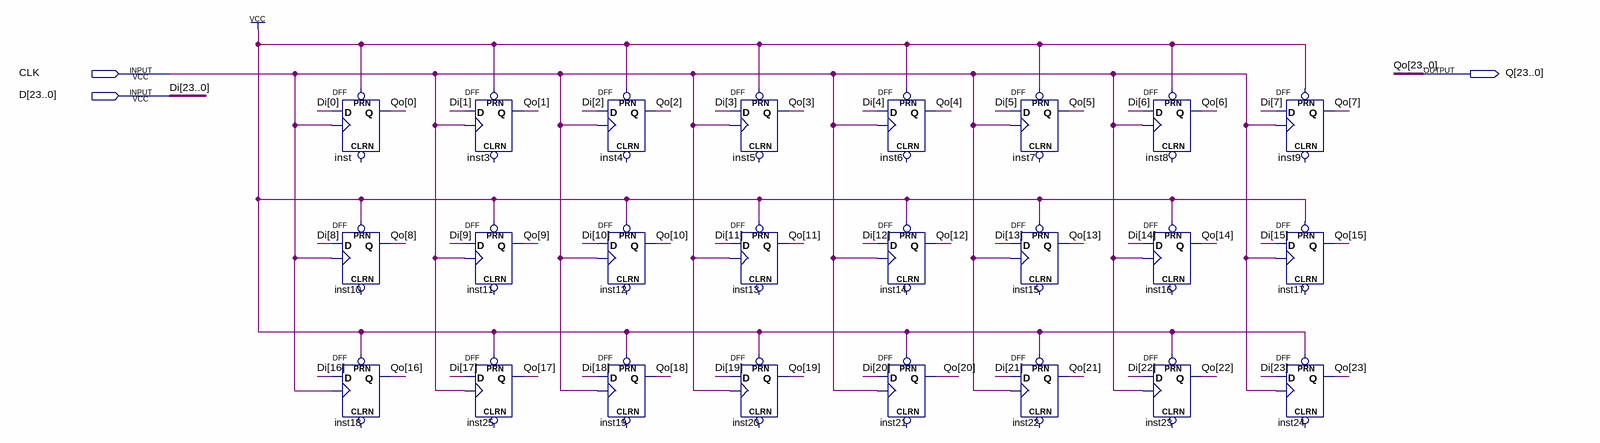
[diagram p0: schematic sheet]
// Quartus schematic uir.bdf as structural Verilog: 24 symbols, 3 pins
module uir (
  input  CLK,
  input  [23:0] D,
  output [23:0] Q
);

  DFF inst (.CLK(CLK), .D(D[0]), .PRN(1'b1), .Q(Q[0]));  // open: CLRN
  DFF inst10 (.CLK(CLK), .D(D[8]), .PRN(1'b1), .Q(Q[8]));  // open: CLRN
  DFF inst18 (.CLK(CLK), .D(D[16]), .PRN(1'b1), .Q(Q[16]));  // open: CLRN
  DFF inst3 (.CLK(CLK), .D(D[1]), .PRN(1'b1), .Q(Q[1]));  // open: CLRN
  DFF inst11 (.CLK(CLK), .D(D[9]), .PRN(1'b1), .Q(Q[9]));  // open: CLRN
  DFF inst25 (.CLK(CLK), .D(D[17]), .PRN(1'b1), .Q(Q[17]));  // open: CLRN
  DFF inst4 (.CLK(CLK), .D(D[2]), .PRN(1'b1), .Q(Q[2]));  // open: CLRN
  DFF inst12 (.CLK(CLK), .D(D[10]), .PRN(1'b1), .Q(Q[10]));  // open: CLRN
  DFF inst19 (.CLK(CLK), .D(D[18]), .PRN(1'b1), .Q(Q[18]));  // open: CLRN
  DFF inst5 (.CLK(CLK), .D(D[3]), .PRN(1'b1), .Q(Q[3]));  // open: CLRN
  DFF inst13 (.CLK(CLK), .D(D[11]), .PRN(1'b1), .Q(Q[11]));  // open: CLRN
  DFF inst20 (.CLK(CLK), .D(D[19]), .PRN(1'b1), .Q(Q[19]));  // open: CLRN
  DFF inst6 (.CLK(CLK), .D(D[4]), .PRN(1'b1), .Q(Q[4]));  // open: CLRN
  DFF inst14 (.CLK(CLK), .D(D[12]), .PRN(1'b1), .Q(Q[12]));  // open: CLRN
  DFF inst21 (.CLK(CLK), .D(D[20]), .PRN(1'b1), .Q(Q[20]));  // open: CLRN
  DFF inst7 (.CLK(CLK), .D(D[5]), .PRN(1'b1), .Q(Q[5]));  // open: CLRN
  DFF inst15 (.CLK(CLK), .D(D[13]), .PRN(1'b1), .Q(Q[13]));  // open: CLRN
  DFF inst22 (.CLK(CLK), .D(D[21]), .PRN(1'b1), .Q(Q[21]));  // open: CLRN
  DFF inst8 (.CLK(CLK), .D(D[6]), .PRN(1'b1), .Q(Q[6]));  // open: CLRN
  DFF inst16 (.CLK(CLK), .D(D[14]), .PRN(1'b1), .Q(Q[14]));  // open: CLRN
  DFF inst23 (.CLK(CLK), .D(D[22]), .PRN(1'b1), .Q(Q[22]));  // open: CLRN
  DFF inst9 (.CLK(CLK), .D(D[7]), .PRN(1'b1), .Q(Q[7]));  // open: CLRN
  DFF inst17 (.CLK(CLK), .D(D[15]), .PRN(1'b1), .Q(Q[15]));  // open: CLRN
  DFF inst24 (.CLK(CLK), .D(D[23]), .PRN(1'b1), .Q(Q[23]));  // open: CLRN

  // Other names for the same wires on the sheet: Di[23:0] = D; Qo[23:0] = Q
endmodule
